# Altium project Sidekick Carrier - Rev. 1.PrjPcb (part 4 of 6)

## Sheet 11 Camera Input.SchDoc
size C; DocumentNumber: 11; SheetNumber: 11; SheetTotal: 17
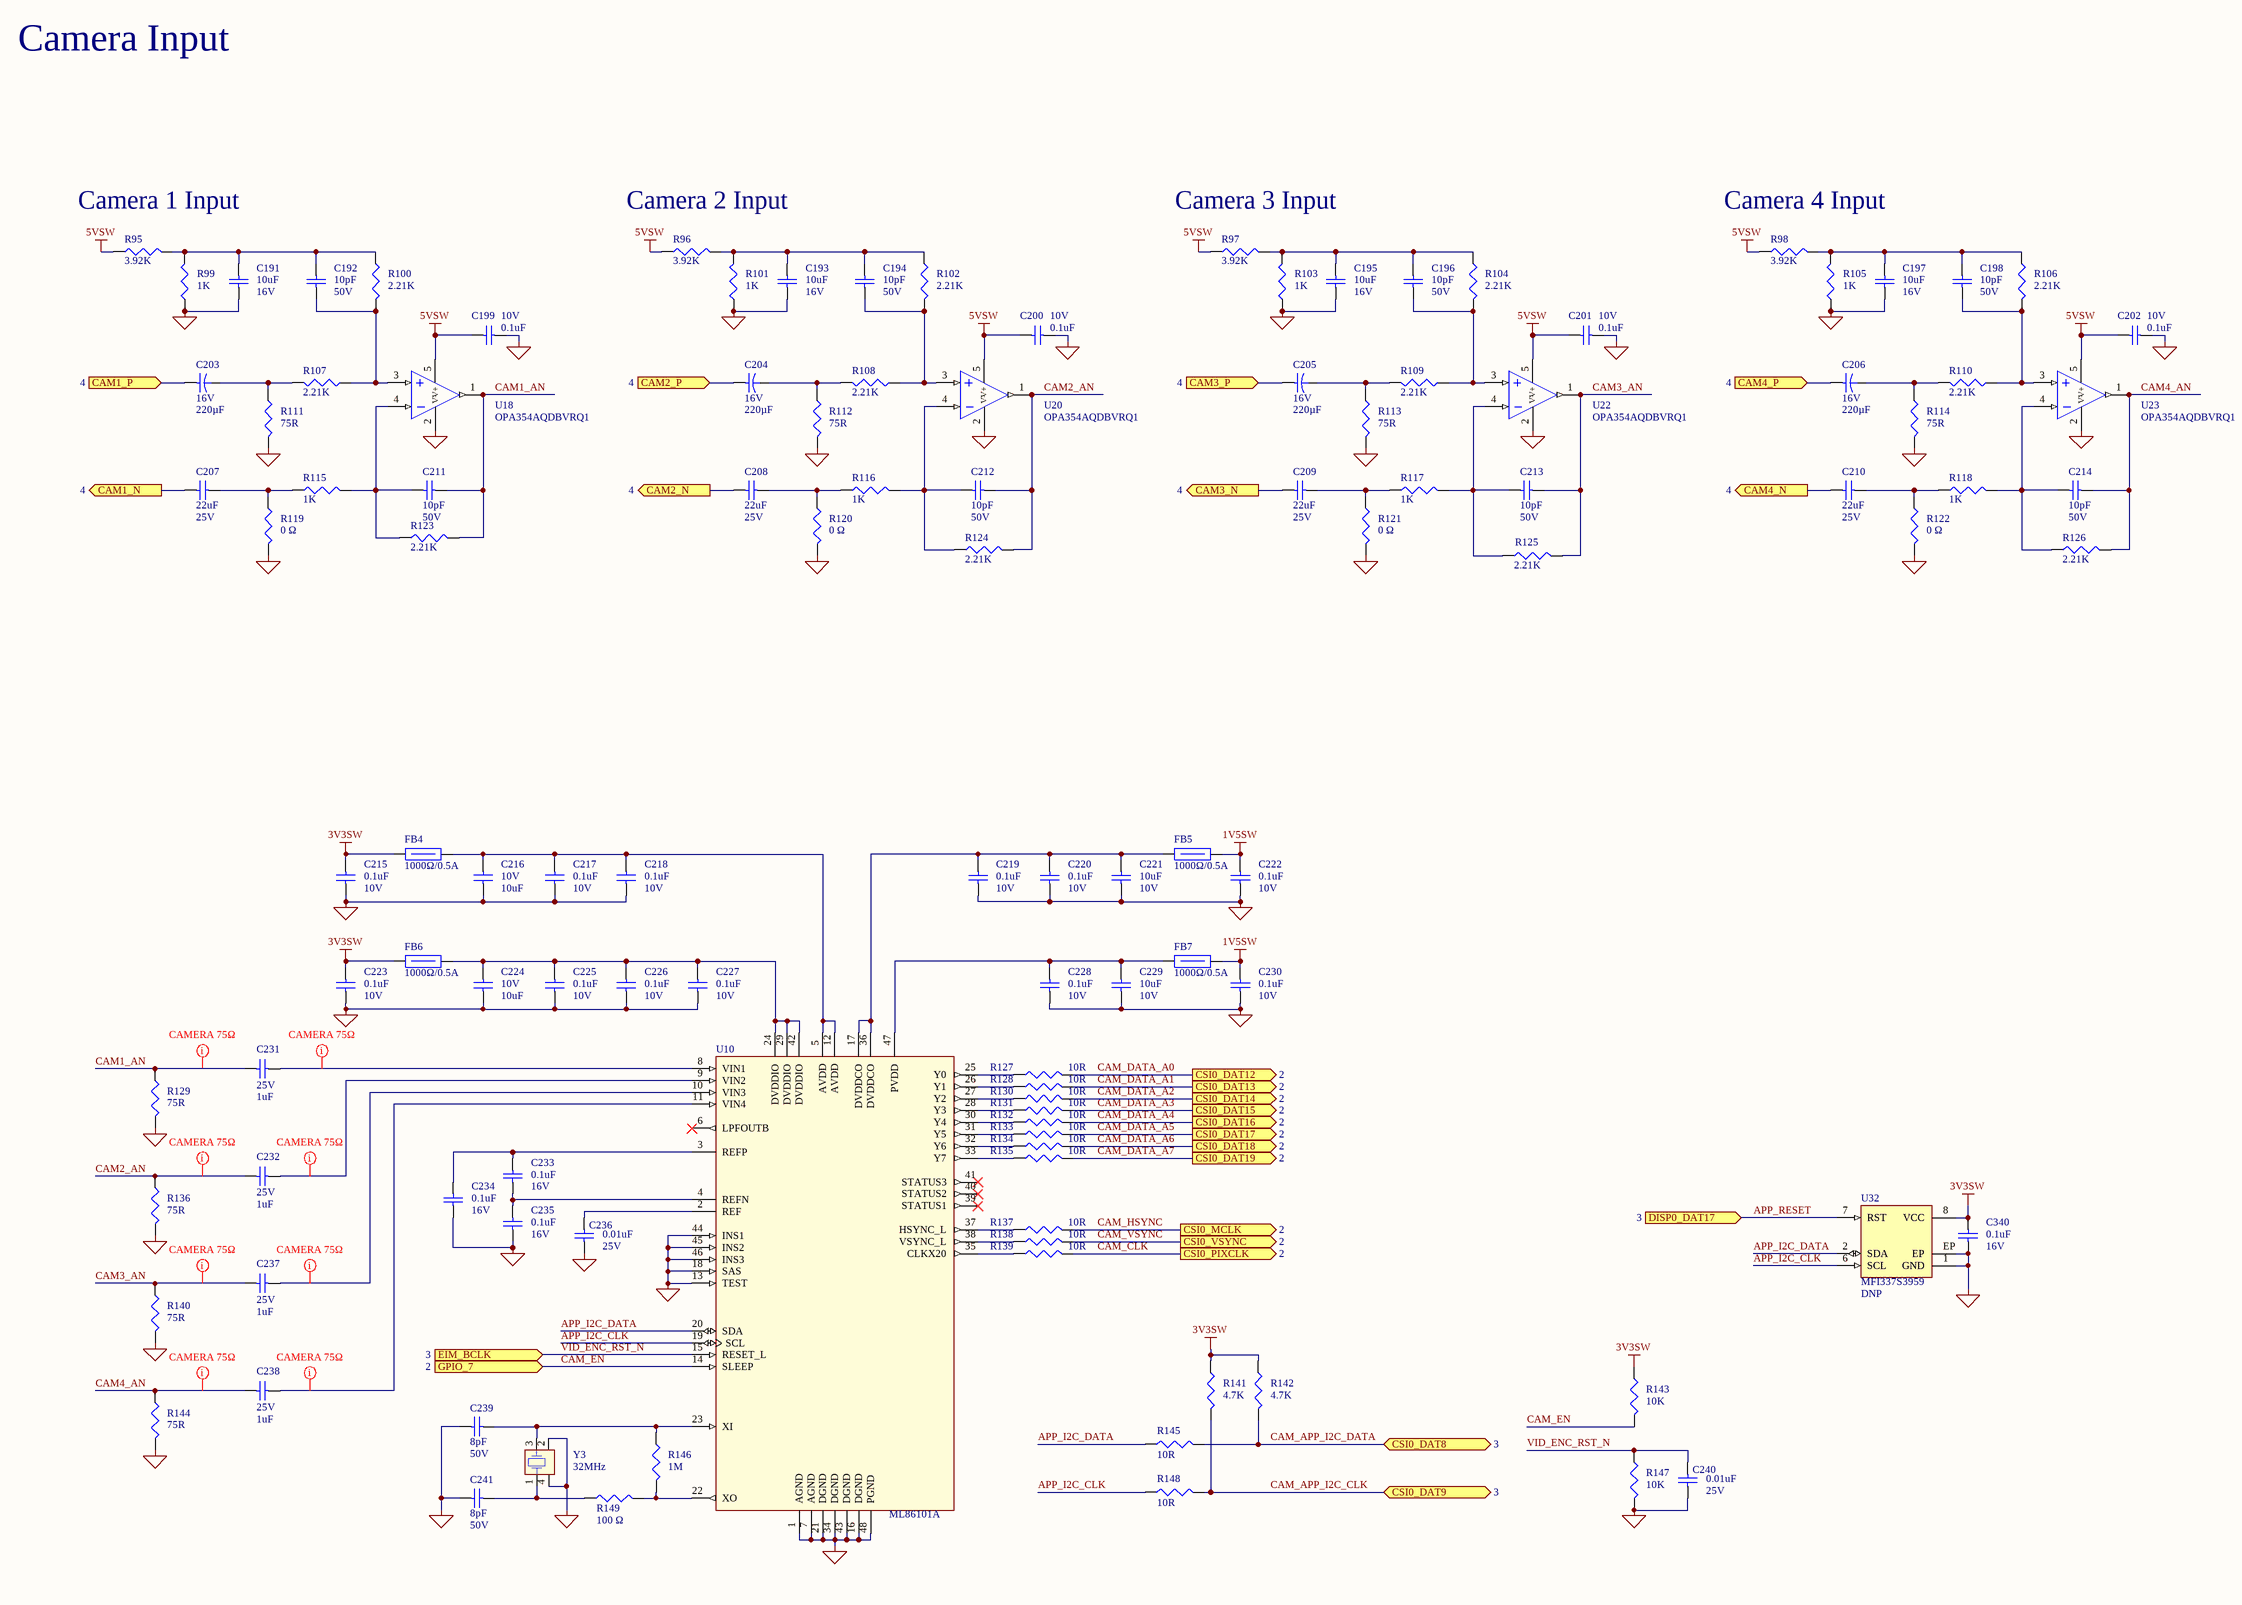
[diagram p10: 11 Camera Input.SchDoc]

### Parts
C191  value 10uF  Voltage: 16V  [CAP_0603]  (hidden comment: Cap 10uF 16V 0603)
C192  value 10pF  Voltage: 50V  [CAP_0402]  (hidden comment: Cap 10pF 50V 0402)
C193  value 10uF  Voltage: 16V  [CAP_0603]  (hidden comment: Cap 10uF 16V 0603)
C194  value 10pF  Voltage: 50V  [CAP_0402]  (hidden comment: Cap 10pF 50V 0402)
C195  value 10uF  Voltage: 16V  [CAP_0603]  (hidden comment: Cap 10uF 16V 0603)
C196  value 10pF  Voltage: 50V  [CAP_0402]  (hidden comment: Cap 10pF 50V 0402)
C197  value 10uF  Voltage: 16V  [CAP_0603]  (hidden comment: Cap 10uF 16V 0603)
C198  value 10pF  Voltage: 50V  [CAP_0402]  (hidden comment: Cap 10pF 50V 0402)
C199  value 0.1uF  Voltage: 10V  [CAP_0402]  (hidden comment: Cap 0.1uF 10V 0402)
C200  value 0.1uF  Voltage: 10V  [CAP_0402]  (hidden comment: Cap 0.1uF 10V 0402)
C201  value 0.1uF  Voltage: 10V  [CAP_0402]  (hidden comment: Cap 0.1uF 10V 0402)
C202  value 0.1uF  Voltage: 10V  [CAP_0402]  (hidden comment: Cap 0.1uF 10V 0402)
C203  value 220µF  Voltage: 16V  [SMD(6.6x6.6)_UWT1C221MCL1GS]  (hidden comment: Cap 220µF 16V)
C204  value 220µF  Voltage: 16V  [SMD(6.6x6.6)_UWT1C221MCL1GS]  (hidden comment: Cap 220µF 16V)
C205  value 220µF  Voltage: 16V  [SMD(6.6x6.6)_UWT1C221MCL1GS]  (hidden comment: Cap 220µF 16V)
C206  value 220µF  Voltage: 16V  [SMD(6.6x6.6)_UWT1C221MCL1GS]  (hidden comment: Cap 220µF 16V)
C207  value 22uF  Voltage: 25V  [CAP_0805]  (hidden comment: Cap 22uF 25V 0805)
C208  value 22uF  Voltage: 25V  [CAP_0805]  (hidden comment: Cap 22uF 25V 0805)
C209  value 22uF  Voltage: 25V  [CAP_0805]  (hidden comment: Cap 22uF 25V 0805)
C210  value 22uF  Voltage: 25V  [CAP_0805]  (hidden comment: Cap 22uF 25V 0805)
C211  value 10pF  Voltage: 50V  [CAP_0402]  (hidden comment: Cap 10pF 50V 0402)
C212  value 10pF  Voltage: 50V  [CAP_0402]  (hidden comment: Cap 10pF 50V 0402)
C213  value 10pF  Voltage: 50V  [CAP_0402]  (hidden comment: Cap 10pF 50V 0402)
C214  value 10pF  Voltage: 50V  [CAP_0402]  (hidden comment: Cap 10pF 50V 0402)
C215  value 0.1uF  Voltage: 10V  [CAP_0402]  (hidden comment: Cap 0.1uF 10V 0402)
C216  value 10uF  Voltage: 10V  [CAP_0603]  (hidden comment: Cap 10uF 10V 0603)
C217  value 0.1uF  Voltage: 10V  [CAP_0402]  (hidden comment: Cap 0.1uF 10V 0402)
C218  value 0.1uF  Voltage: 10V  [CAP_0402]  (hidden comment: Cap 0.1uF 10V 0402)
C219  value 0.1uF  Voltage: 10V  [CAP_0402]  (hidden comment: Cap 0.1uF 10V 0402)
C220  value 0.1uF  Voltage: 10V  [CAP_0402]  (hidden comment: Cap 0.1uF 10V 0402)
C221  value 10uF  Voltage: 10V  [CAP_0603]  (hidden comment: Cap 10uF 10V 0603)
C222  value 0.1uF  Voltage: 10V  [CAP_0402]  (hidden comment: Cap 0.1uF 10V 0402)
C223  value 0.1uF  Voltage: 10V  [CAP_0402]  (hidden comment: Cap 0.1uF 10V 0402)
C224  value 10uF  Voltage: 10V  [CAP_0603]  (hidden comment: Cap 10uF 10V 0603)
C225  value 0.1uF  Voltage: 10V  [CAP_0402]  (hidden comment: Cap 0.1uF 10V 0402)
C226  value 0.1uF  Voltage: 10V  [CAP_0402]  (hidden comment: Cap 0.1uF 10V 0402)
C227  value 0.1uF  Voltage: 10V  [CAP_0402]  (hidden comment: Cap 0.1uF 10V 0402)
C228  value 0.1uF  Voltage: 10V  [CAP_0402]  (hidden comment: Cap 0.1uF 10V 0402)
C229  value 10uF  Voltage: 10V  [CAP_0603]  (hidden comment: Cap 10uF 10V 0603)
C230  value 0.1uF  Voltage: 10V  [CAP_0402]  (hidden comment: Cap 0.1uF 10V 0402)
C231  value 1uF  Voltage: 25V  [CAP_0402]  (hidden comment: Cap 1uF 25V 0402)
C232  value 1uF  Voltage: 25V  [CAP_0402]  (hidden comment: Cap 1uF 25V 0402)
C233  value 0.1uF  Voltage: 16V  [CAP_0402]  (hidden comment: Cap 0.1uF 16V 0402)
C234  value 0.1uF  Voltage: 16V  [CAP_0402]  (hidden comment: Cap 0.1uF 16V 0402)
C235  value 0.1uF  Voltage: 16V  [CAP_0402]  (hidden comment: Cap 0.1uF 16V 0402)
C236  value 0.01uF  Voltage: 25V  [CAP_0402]  (hidden comment: Cap 0.01uF 50V 0402)
C237  value 1uF  Voltage: 25V  [CAP_0402]  (hidden comment: Cap 1uF 25V 0402)
C238  value 1uF  Voltage: 25V  [CAP_0402]  (hidden comment: Cap 1uF 25V 0402)
C239  value 8pF  Voltage: 50V  [CAP_0402]  (hidden comment: Cap 8pF 50V 0402)
C240  value 0.01uF  Voltage: 25V  [CAP_0402]  (hidden comment: Cap 0.01uF 50V 0402)
C241  value 8pF  Voltage: 50V  [CAP_0402]  (hidden comment: Cap 8pF 50V 0402)
C340  value 0.1uF  Voltage: 16V  [CAP_0402]  (hidden comment: Cap 0.1uF 16V 0402)
FB4  value 1000Ω/0.5A  [IND_0805]  (hidden comment: PE-0805FB102ST)
FB5  value 1000Ω/0.5A  [IND_0805]  (hidden comment: PE-0805FB102ST)
FB6  value 1000Ω/0.5A  [IND_0805]  (hidden comment: PE-0805FB102ST)
FB7  value 1000Ω/0.5A  [IND_0805]  (hidden comment: PE-0805FB102ST)
R95  value 3.92K  [RES_0402]  (hidden comment: Res 3.92K 0.063W)
R96  value 3.92K  [RES_0402]  (hidden comment: Res 3.92K 0.063W)
R97  value 3.92K  [RES_0402]  (hidden comment: Res 3.92K 0.063W)
R98  value 3.92K  [RES_0402]  (hidden comment: Res 3.92K 0.063W)
R99  value 1K  [RES_0402]  (hidden comment: Res 1K 0.063W)
R100  value 2.21K  [RES_0402]  (hidden comment: Res 2.21K 0.063W)
R101  value 1K  [RES_0402]  (hidden comment: Res 1K 0.063W)
R102  value 2.21K  [RES_0402]  (hidden comment: Res 2.21K 0.063W)
R103  value 1K  [RES_0402]  (hidden comment: Res 1K 0.063W)
R104  value 2.21K  [RES_0402]  (hidden comment: Res 2.21K 0.063W)
R105  value 1K  [RES_0402]  (hidden comment: Res 1K 0.063W)
R106  value 2.21K  [RES_0402]  (hidden comment: Res 2.21K 0.063W)
R107  value 2.21K  [RES_0402]  (hidden comment: Res 2.21K 0.063W)
R108  value 2.21K  [RES_0402]  (hidden comment: Res 2.21K 0.063W)
R109  value 2.21K  [RES_0402]  (hidden comment: Res 2.21K 0.063W)
R110  value 2.21K  [RES_0402]  (hidden comment: Res 2.21K 0.063W)
R111  value 75R  [RES_0402]  (hidden comment: Res 75R 0.063W)
R112  value 75R  [RES_0402]  (hidden comment: Res 75R 0.063W)
R113  value 75R  [RES_0402]  (hidden comment: Res 75R 0.063W)
R114  value 75R  [RES_0402]  (hidden comment: Res 75R 0.063W)
R115  value 1K  [RES_0402]  (hidden comment: Res 1K 0.063W)
R116  value 1K  [RES_0402]  (hidden comment: Res 1K 0.063W)
R117  value 1K  [RES_0402]  (hidden comment: Res 1K 0.063W)
R118  value 1K  [RES_0402]  (hidden comment: Res 1K 0.063W)
R119  value 0 Ω  [RES_0402]  (hidden comment: Res 0 ohm 0.1W)
R120  value 0 Ω  [RES_0402]  (hidden comment: Res 0 ohm 0.1W)
R121  value 0 Ω  [RES_0402]  (hidden comment: Res 0 ohm 0.1W)
R122  value 0 Ω  [RES_0402]  (hidden comment: Res 0 ohm 0.1W)
R123  value 2.21K  [RES_0402]  (hidden comment: Res 2.21K 0.063W)
R124  value 2.21K  [RES_0402]  (hidden comment: Res 2.21K 0.063W)
R125  value 2.21K  [RES_0402]  (hidden comment: Res 2.21K 0.063W)
R126  value 2.21K  [RES_0402]  (hidden comment: Res 2.21K 0.063W)
R127  value 10R  [RES_0402]  (hidden comment: Res 10R 0.1W)
R128  value 10R  [RES_0402]  (hidden comment: Res 10R 0.1W)
R129  value 75R  [RES_0402]  (hidden comment: Res 75R 0.063W)
R130  value 10R  [RES_0402]  (hidden comment: Res 10R 0.1W)
R131  value 10R  [RES_0402]  (hidden comment: Res 10R 0.1W)
R132  value 10R  [RES_0402]  (hidden comment: Res 10R 0.1W)
R133  value 10R  [RES_0402]  (hidden comment: Res 10R 0.1W)
R134  value 10R  [RES_0402]  (hidden comment: Res 10R 0.1W)
R135  value 10R  [RES_0402]  (hidden comment: Res 10R 0.1W)
R136  value 75R  [RES_0402]  (hidden comment: Res 75R 0.063W)
R137  value 10R  [RES_0402]  (hidden comment: Res 10R 0.1W)
R138  value 10R  [RES_0402]  (hidden comment: Res 10R 0.1W)
R139  value 10R  [RES_0402]  (hidden comment: Res 10R 0.1W)
R140  value 75R  [RES_0402]  (hidden comment: Res 75R 0.063W)
R141  value 4.7K  [RES_0402]  (hidden comment: Res 4.7K 0.063W)
R142  value 4.7K  [RES_0402]  (hidden comment: Res 4.7K 0.063W)
R143  value 10K  [RES_0402]  (hidden comment: Res 10K 0.063W)
R144  value 75R  [RES_0402]  (hidden comment: Res 75R 0.063W)
R145  value 10R  [RES_0402]  (hidden comment: Res 10R 0.1W)
R146  value 1M  [RES_0402]  (hidden comment: Res 1M 0.063W)
R147  value 10K  [RES_0402]  (hidden comment: Res 10K 0.063W)
R148  value 10R  [RES_0402]  (hidden comment: Res 10R 0.1W)
R149  value 100 Ω  [RES_0402]  (hidden comment: Res 100R 0.063W)
U10  ML86101A  [TQFP-48_ML86101A]
U18  OPA354AQDBVRQ1  [SOT-23-5_OPA354A-Q1]
U20  OPA354AQDBVRQ1  [SOT-23-5_OPA354A-Q1]
U22  OPA354AQDBVRQ1  [SOT-23-5_OPA354A-Q1]
U23  OPA354AQDBVRQ1  [SOT-23-5_OPA354A-Q1]
U32  MFI337S3959  [CP8PMFI-MFI337S3959]
Y3  value 32MHz  [DFN(3.2x2.5)_CX3225SB32000D0FPLCC]  (hidden comment: CX3225SB32000D0FPLCC)

### Ports
CAM1_N (out, see 4), CAM1_P (in, see 4), CAM2_N (out, see 4), CAM2_P (in, see 4), CAM3_N (out, see 4), CAM3_P (in, see 4), CAM4_N (out, see 4), CAM4_P (in, see 4), CSI0_DAT8 (bidir, see 3), CSI0_DAT9 (bidir, see 3), CSI0_DAT12 (out, see 2), CSI0_DAT13 (out, see 2), CSI0_DAT14 (out, see 2), CSI0_DAT15 (out, see 2), CSI0_DAT16 (out, see 2), CSI0_DAT17 (out, see 2), CSI0_DAT18 (out, see 2), CSI0_DAT19 (out, see 2), CSI0_MCLK (out, see 2), CSI0_PIXCLK (out, see 2), CSI0_VSYNC (out, see 2), DISP0_DAT17 (in, see 3), EIM_BCLK (in, see 3), GPIO_7 (in, see 2)

### Nets
1V5SW: C222.1 C230.1 FB5.2 FB7.2
3V3SW: C215.1 C223.1 C340.1 FB4.1 FB6.1 R141.1 R142.1 R143.1 U32.8(VCC)
5VSW: C199.1 C200.1 C201.1 C202.1 R95.1 R96.1 R97.1 R98.1 U18.5(V+) U20.5(V+) U22.5(V+) U23.5(V+)
GND: C191.2 C193.2 C195.2 C197.2 C199.2 C200.2 C201.2 C202.2 C215.2 C216.2 C217.2 C218.2 C219.2 C220.2 C221.2 C222.2 C223.2 C224.2 C225.2 C226.2 C227.2 C228.2 C229.2 C230.2 C234.2 C235.2 C236.2 C239.1 C240.2 C241.1 C340.2 R99.1 R101.1 R103.1 R105.1 R111.2 R112.2 R113.2 R114.2 R119.2 R120.2 R121.2 R122.2 R129.2 R136.2 R140.2 R144.2 R147.2 U10.1(AGND) U10.7(AGND) U10.13(TEST) U10.16(DGND) U10.18(SAS) U10.21(DGND) U10.34(DGND) U10.43(DGND) U10.44(INS1) U10.45(INS2) U10.46(INS3) U10.48(PGND) U18.2(V-) U20.2(V-) U22.2(V-) U23.2(V-) U32.1(GND) U32.EP Y3.2 Y3.4
APP_I2C_CLK: R148.1 U10.19(SCL) U32.6(SCL)
APP_I2C_DATA: R145.1 U10.20(SDA) U32.2(SDA)
APP_RESET: U32.7(RST) ; port DISP0_DAT17
CAM1_AN: C211.2 C231.1 R123.2 R129.1 U18.1(OUT)
CAM1_N: C207.1 ; port CAM1_N
CAM1_P: C203.1 ; port CAM1_P
CAM2_AN: C212.2 C232.1 R124.2 R136.1 U20.1(OUT)
CAM2_N: C208.1 ; port CAM2_N
CAM2_P: C204.1 ; port CAM2_P
CAM3_AN: C213.2 C237.1 R125.2 R140.1 U22.1(OUT)
CAM3_N: C209.1 ; port CAM3_N
CAM3_P: C205.1 ; port CAM3_P
CAM4_AN: C214.2 C238.1 R126.2 R144.1 U23.1(OUT)
CAM4_N: C210.1 ; port CAM4_N
CAM4_P: C206.1 ; port CAM4_P
CAM_APP_I2C_CLK: R141.2 R148.2 ; port CSI0_DAT9
CAM_APP_I2C_DATA: R142.2 R145.2 ; port CSI0_DAT8
CAM_CLK: R139.2 ; port CSI0_PIXCLK
CAM_DATA_A0: R127.2 ; port CSI0_DAT12
CAM_DATA_A1: R128.2 ; port CSI0_DAT13
CAM_DATA_A2: R130.2 ; port CSI0_DAT14
CAM_DATA_A3: R131.2 ; port CSI0_DAT15
CAM_DATA_A4: R132.2 ; port CSI0_DAT16
CAM_DATA_A5: R133.2 ; port CSI0_DAT17
CAM_DATA_A6: R134.2 ; port CSI0_DAT18
CAM_DATA_A7: R135.2 ; port CSI0_DAT19
CAM_EN: R143.2 U10.14(SLEEP) ; port GPIO_7
CAM_HSYNC: R137.2 ; port CSI0_MCLK
CAM_VSYNC: R138.2 ; port CSI0_VSYNC
VID_ENC_RST_N: C240.1 R147.1 U10.15(RESET_L) ; port EIM_BCLK
NetC191_1: C191.1 C192.2 R95.2 R99.2 R100.1
NetC192_1: C192.1 R100.2 R107.1 U18.3(IN+)
NetC193_1: C193.1 C194.2 R96.2 R101.2 R102.1
NetC194_1: C194.1 R102.2 R108.1 U20.3(IN+)
NetC195_1: C195.1 C196.2 R97.2 R103.2 R104.1
NetC196_1: C196.1 R104.2 R109.1 U22.3(IN+)
NetC197_1: C197.1 C198.2 R98.2 R105.2 R106.1
NetC198_1: C198.1 R106.2 R110.1 U23.3(IN+)
NetC203_2: C203.2 R107.2 R111.1
NetC204_2: C204.2 R108.2 R112.1
NetC205_2: C205.2 R109.2 R113.1
NetC206_2: C206.2 R110.2 R114.1
NetC207_2: C207.2 R115.1 R119.1
NetC208_2: C208.2 R116.1 R120.1
NetC209_2: C209.2 R117.1 R121.1
NetC210_2: C210.2 R118.1 R122.1
NetC211_1: C211.1 R115.2 R123.1 U18.4(IN-)
NetC212_1: C212.1 R116.2 R124.1 U20.4(IN-)
NetC213_1: C213.1 R117.2 R125.1 U22.4(IN-)
NetC214_1: C214.1 R118.2 R126.1 U23.4(IN-)
NetC216_1: C216.1 C217.1 C218.1 FB4.2 U10.5(AVDD) U10.12(AVDD)
NetC219_1: C219.1 C220.1 C221.1 FB5.1 U10.17(DVDDCO) U10.36(DVDDCO)
NetC224_1: C224.1 C225.1 C226.1 C227.1 FB6.2 U10.24(DVDDIO) U10.29(DVDDIO) U10.42(DVDDIO)
NetC228_1: C228.1 C229.1 FB7.1 U10.47(PVDD)
NetC231_2: C231.2 U10.8(VIN1)
NetC232_2: C232.2 U10.9(VIN2)
NetC233_1: C233.1 C234.1 U10.3(REFP)
NetC233_2: C233.2 C235.1 U10.4(REFN)
NetC236_1: C236.1 U10.2(REF)
NetC237_2: C237.2 U10.10(VIN3)
NetC238_2: C238.2 U10.11(VIN4)
NetC239_2: C239.2 R146.1 U10.23(XI) Y3.3(OSC2)
NetC241_2: C241.2 R149.1 Y3.1(OSC1)
NetR127_1: R127.1 U10.25(Y0)
NetR128_1: R128.1 U10.26(Y1)
NetR130_1: R130.1 U10.27(Y2)
NetR131_1: R131.1 U10.28(Y3)
NetR132_1: R132.1 U10.30(Y4)
NetR133_1: R133.1 U10.31(Y5)
NetR134_1: R134.1 U10.32(Y6)
NetR135_1: R135.1 U10.33(Y7)
NetR137_1: R137.1 U10.37(HSYNC_L)
NetR138_1: R138.1 U10.38(VSYNC_L)
NetR139_1: R139.1 U10.35(CLKX20)
NetR146_2: R146.2 R149.2 U10.22(XO)

Not connected (* = marked no-connect by the designer): U10 6(LPFOUTB)* 39(STATUS1)* 40(STATUS2)* 41(STATUS3)*

### Layout directives
net class CAMERA 75ohm: CAM1_AN, CAM2_AN, CAM3_AN, CAM4_AN, NetC231_2, NetC232_2, NetC237_2, NetC238_2

### Notes on the sheet
- Camera Input
- Camera 1 Input
- Camera 2 Input
- Camera 3 Input
- Camera 4 Input
- First View Consultants
- Austin, Tx
- 512.582.9102
- firstviewconsultants.com
- Title:
- File:
- Drawn:
- Sheet
- of
- FVC #:
- Checked:
- Approved:
- Date:
- Page Size:
- C
- Rev.
- Time:

### Library data of the parts
C191 C193 C195 C197 = Cap 10uF 16V 0603: Cap, Cer, 10uF, 16V, 20%, X5R, 0603; Manufacturer #: GRM188C81C106MA73D; Manufacturer: Murata Electronics North America; Have Footprint: yes; RoHS: yes; Tolerance: ±20%; Operating Temperature: -55°C ~ 85°C; Package: 0603
C192 C194 C196 C198 C211-C214 = Cap 10pF 50V 0402: Cap, Cer, 10pF, 50V, 5%, C0G/NP0, 0402; Manufacturer: Yageo; Manufacturer #: CC0402JRNPO9BN100; Have Footprint: yes; Tolerance: 5%; PACKAGE: 0402; Operating Temperature: -55°C ~ 125°C
C199-C202 C215 C217-C220 C222 C223 C225-C228 C230 = Cap 0.1uF 10V 0402: Cap, Cer, 0.1uF, 10V, 10%, X5R, 0402; Manufacturer: Murata Electronics North America; Manufacturer #: GRM155R61A104KA01J; Have Footprint: yes; Tolerance: ±10%; PACKAGE: 0402
C203-C206 = Cap 220µF 16V: Cap, Alum, 220µF, 16V, 20%, SMD; Manufacturer #: UWT1C221MCL1GS; Manufacturer: Nichicon; Tolerance: 20%; Package: SMD  (6.6x6.6); Operating Temperature: -55°C ~ 105°C
C207-C210 = Cap 22uF 25V 0805: Cap, Cer, 22uF, 25V, 20%, X5R, 0805; Manufacturer #: CL21A226MAQNNNE; Manufacturer: Samsung Electro-Mechanics America, Inc; Have Footprint: yes; Tolerance: ±20%; Package: 0805
C216 C221 C224 C229 = Cap 10uF 10V 0603: Cap, Cer, 10uF, 10V, 10%, X5R, 0603; Manufacturer #: C1608X5R1A106K080AC; Manufacturer: TDK Corporation; Have Footprint: yes; Package: 0603; Tolerance: ±10%
C231 C232 C237 C238 = Cap 1uF 25V 0402: Cap, Cer, 1uF, 25V, 10%, X5R, 0402; Manufacturer #: TMK105BJ105MV-F; Manufacturer: Taiyo Yuden; Have Footprint: yes; Package: 0402
C233-C235 C340 = Cap 0.1uF 16V 0402: Cap, Cer, 0.1uF, 16V, 10%, X7R, 0402; Manufacturer #: GRM155R71C104KA88D; Manufacturer: Murata Electronics North America; Have Footprint: yes; Package: 0402; Tolerance: ±10%
C236 C240 = Cap 0.01uF 50V 0402: Cap, Cer, 0.01uF, 25V, ±10%, X7R, 0402; Manufacturer #: GRM155R71E103KA01J; Manufacturer: Murata; Have Footprint: yes; Tolerance: ±10%; Package: 0402
C239 C241 = Cap 8pF 50V 0402: Cap, Cer, 8pF, 50V, ±0.5pF, C0G/NP0, 0402; Manufacturer: Murata Electronics North America; Manufacturer #: GRM1555C1H8R0DA01D; Have Footprint: yes; Tolerance: ±0.5pF; PACKAGE: 0402; Operating Temperature: -55°C ~ 125°C
FB4-FB7 = PE-0805FB102ST: Ind, Ferrite Bead, 1000R, 0.5A, 400mOhm, 0805; Manufacturer: Pulse Electronics Corporation; Manufacturer #: PE-0805FB102ST; Package: 0805
R95-R98 = Res 3.92K 0.063W: Res, 3.92K, 0.063W, 1%, 0402; Manufacturer #: MCR01MRTF3921; Manufacturer: Rohm Semiconductor; Have Footprint: yes; Package: 0402; Operating Temperature: -55°C ~ 155°C; Tolerance: 1%
R99 R101 R103 R105 R115-R118 = Res 1K 0.063W: Res, 1K, 0.063W, 1%, 0402; Manufacturer #: CRCW04021K00FKED; Manufacturer: Vishay Dale; Have Footprint: yes; Package: 0402; Tolerance: ±1%
R100 R102 R104 R106-R110 R123-R126 = Res 2.21K 0.063W: Res, 2.21K, 0.063W, 1%, 0402; Manufacturer #: RC0402FR-072K21L; Manufacturer: Yageo; Have Footprint: yes; Package: 0402; Operating Temperature: -55°C ~ 155°C; Tolerance: 1%
R111-R114 R129 R136 R140 R144 = Res 75R 0.063W: Res, 2.21K, 0.063W, 1%, 0402; Manufacturer #: MCR01MRTF75R0; Manufacturer: Rohm Semiconductor; Have Footprint: yes; Package: 0402; Operating Temperature: -55°C ~ 155°C; Tolerance: 1%
R119-R122 = Res 0 ohm 0.1W: Res, 0 ohm, 1/16W, 0402; Manufacturer #: CRCW04020000Z0ED; Manufacturer: Vishay Dale; Have Footprint: yes; Package: 0402
R127 R128 R130-R135 R137-R139 R145 R148 = Res 10R 0.1W: Res, 10R, 0.1W, 0402; Manufacturer #: ERJ-2GEJ100X; Manufacturer: Panasonic Electronic Components; Have Footprint: yes; Package: 0402
R141 R142 = Res 4.7K 0.063W: Res, 4.70K, 0.063W, 1%, 0402; Manufacturer #: CRCW04024K70FKED; Manufacturer: Vishay Dale; Have Footprint: yes; Package: 0402
R143 R147 = Res 10K 0.063W: Res, 10K, 1/16W, 1%, 0402; Manufacturer #: RC0402FR-0710KL; Manufacturer: Yageo; Have Footprint: yes; Package: 0402
R146 = Res 1M 0.063W: Res, 1M, 0.063W, 1%, 0402; Manufacturer #: RC0402FR-071ML; Manufacturer: Yageo; Have Footprint: yes; Package: 0402
R149 = Res 100R 0.063W: Res, 100R, 0.063W, 1%, 0402; Manufacturer #: TRR01MZPF1000; Manufacturer: Murata Electronics North America; Have Footprint: yes; Package: 0402
U10 = ML86101A: IC, Video Decoder, I2C, 4-composite/2-S-video input, TQFP-48; Manufacturer: Lapis Semiconductor; Have Footprint: yes; Manufacturer #: ML86101A; Package: TQFP-48
U18 U20 U22 U23 = OPA354AQDBVRQ1: IC, OpAmp, 250MHz, R-R I/O, SOT-23-5; Manufacturer: Texas Instruments; Have Footprint: yes; Package: SOT-23-5; RoHS: yes; Manufacturer #: OPA354AQDBVRQ1
U32 = MFI337S3959: IC, Apple Authentication Coprocessor, 2.0C, 8USON; Have Footprint: yes; DNP: DNP; Manufacturer #: MFI337S3959; Manufacturer: Apple
Y3 = CX3225SB32000D0FPLCC: Clock, Crystal, 32MHz, 20ppm, 8pF, SMD; Manufacturer: AVX Corp/Kyocera Corp; Operating Temperature: -40°C ~ 85°C; Package: DFN(3.2x2.5); Manufacturer #: CX3225SB32000D0FPLCC

## Sheet 12 CAN, ADC, DAC.SchDoc
size B; DocumentNumber: 12; SheetNumber: 12; SheetTotal: 17
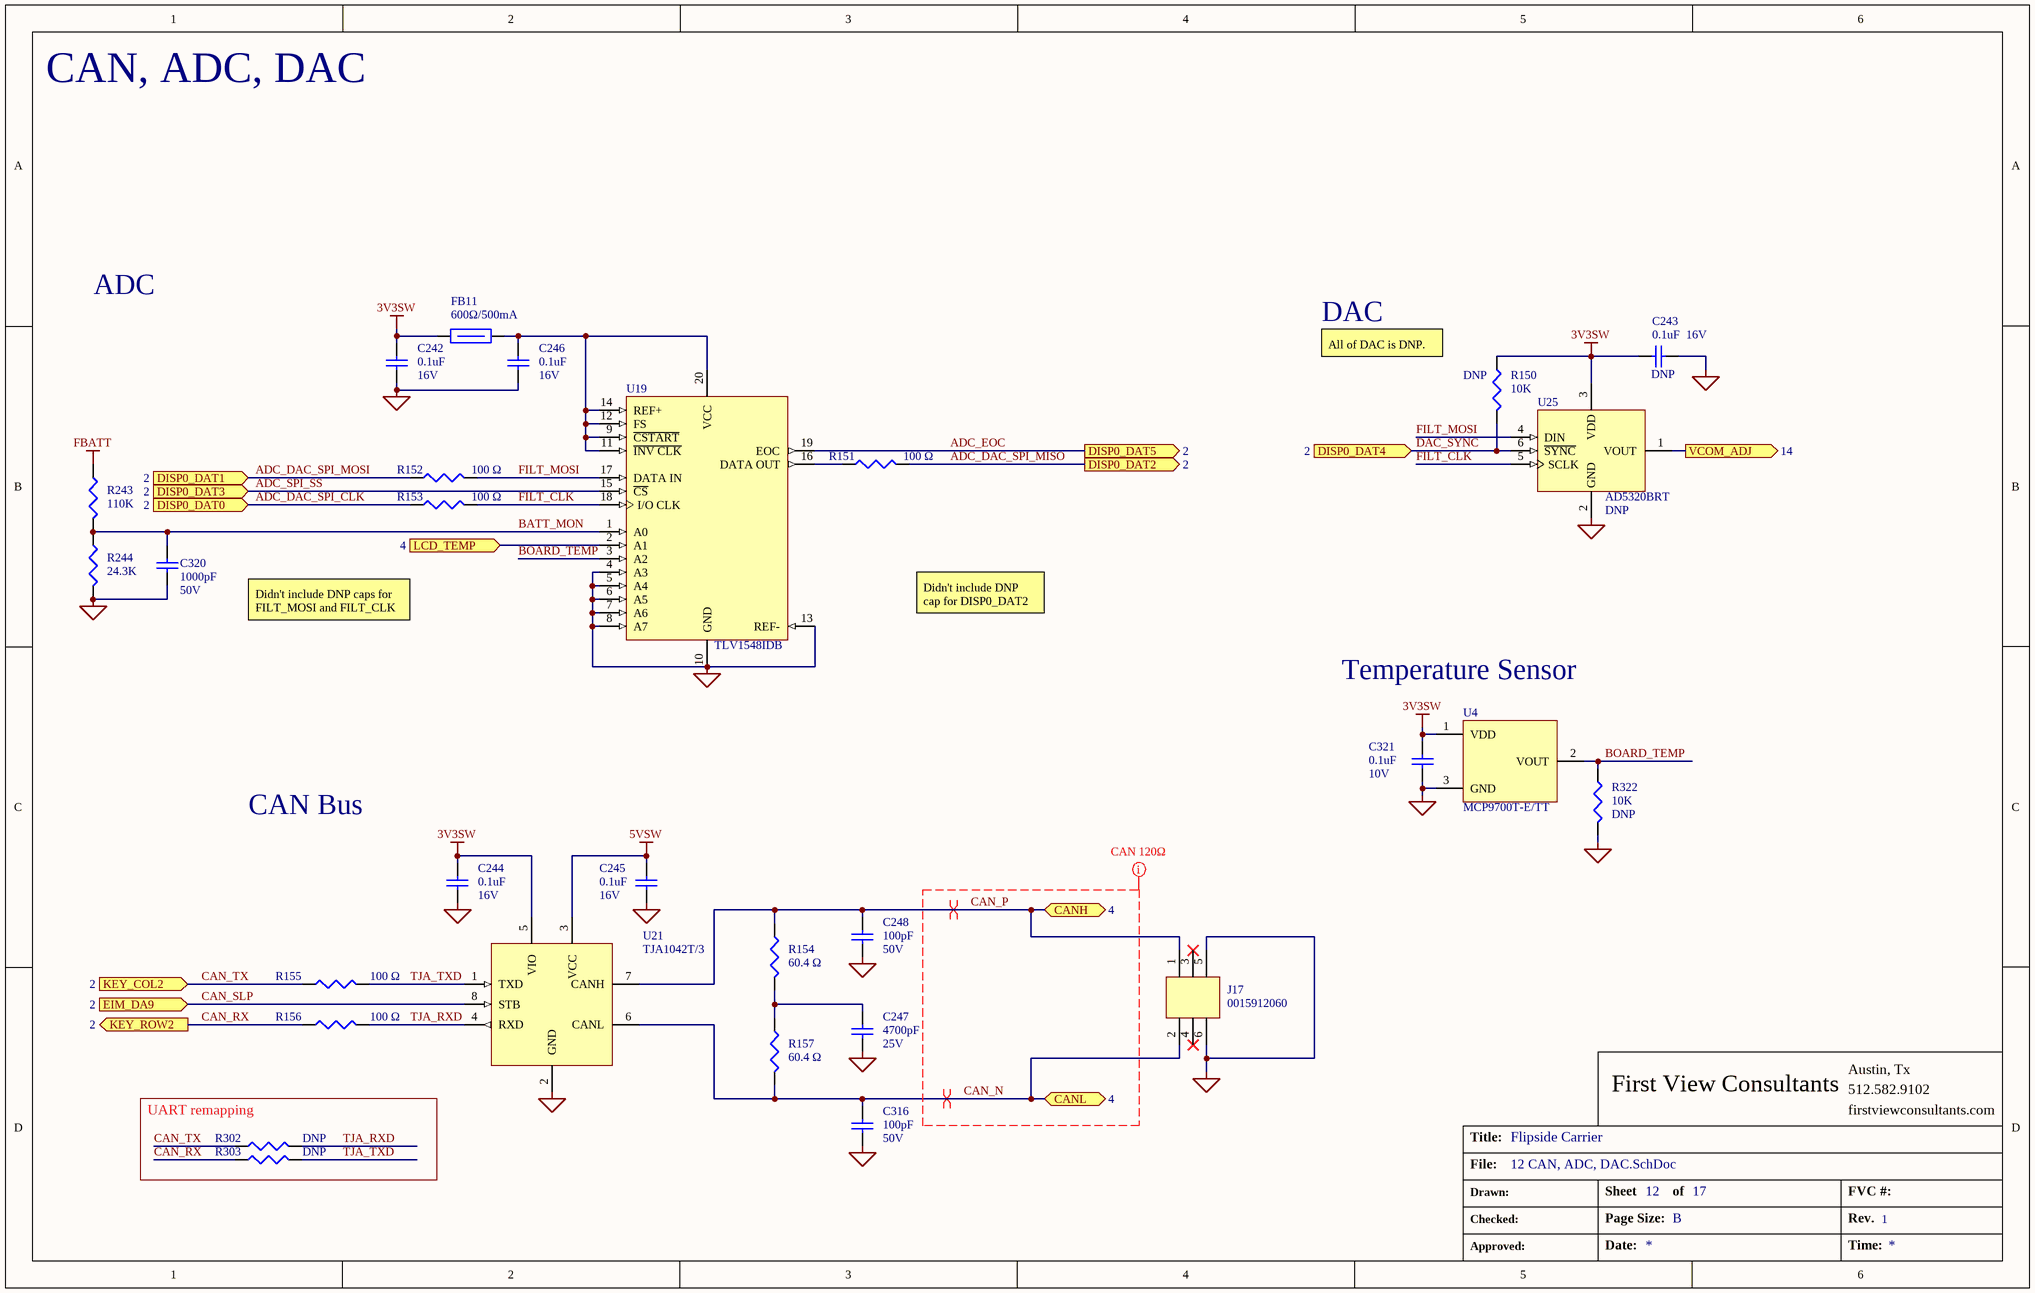
[diagram p11: 12 CAN, ADC, DAC.SchDoc]

### Parts
C242  value 0.1uF  Voltage: 16V  [CAP_0402]  (hidden comment: Cap 0.1uF 16V 0402)
C243  value 0.1uF  Voltage: 16V  [CAP_0402]  (hidden comment: Cap 0.1uF 16V 0402)
C244  value 0.1uF  Voltage: 16V  [CAP_0402]  (hidden comment: Cap 0.1uF 16V 0402)
C245  value 0.1uF  Voltage: 16V  [CAP_0402]  (hidden comment: Cap 0.1uF 16V 0402)
C246  value 0.1uF  Voltage: 16V  [CAP_0402]  (hidden comment: Cap 0.1uF 16V 0402)
C247  value 4700pF  Voltage: 25V  [CAP_0603]  (hidden comment: Cap 4700pF 25V 0603)
C248  value 100pF  Voltage: 50V  [CAP_0402]  (hidden comment: Cap 100pF 50V 0402)
C316  value 100pF  Voltage: 50V  [CAP_0402]  (hidden comment: Cap 100pF 50V 0402)
C320  value 1000pF  Voltage: 50V  [CAP_0402]  (hidden comment: Cap 1000pF 50V 0402)
C321  value 0.1uF  Voltage: 10V  [CAP_0402]  (hidden comment: Cap 0.1uF 10V 0402)
FB11  value 600Ω/500mA  [IND_0603]  (hidden comment: BLM18EG601SN1D)
J17  0015912060  [CON_0015912060]
R150  value 10K  [RES_0402]  (hidden comment: Res 10K 0.063W)
R151  value 100 Ω  [RES_0402]  (hidden comment: Res 100R 0.063W)
R152  value 100 Ω  [RES_0402]  (hidden comment: Res 100R 0.063W)
R153  value 100 Ω  [RES_0402]  (hidden comment: Res 100R 0.063W)
R154  value 60.4 Ω  [RES_0402]  (hidden comment: Res 60.4R 0.063W)
R155  value 100 Ω  [RES_0402]  (hidden comment: Res 100R 0.063W)
R156  value 100 Ω  [RES_0402]  (hidden comment: Res 100R 0.063W)
R157  value 60.4 Ω  [RES_0402]  (hidden comment: Res 60.4R 0.063W)
R243  value 110K  [RES_0402]  (hidden comment: Res 110K 0.063W)
R244  value 24.3K  [RES_0402]  (hidden comment: Res 24.3K 0.063W)
R302  Res 100R 0.063W  [RES_0402]  (value not drawn)
R303  Res 100R 0.063W  [RES_0402]  (value not drawn)
R322  value 10K  [RES_0402]  (hidden comment: Res 10K 0.063W)
U4  MCP9700T-E/TT  [SOT-23-3_MCP9700T-E/TT]
U19  TLV1548IDB  [SSOP-20_TLV1548IDB]
U21  TJA1042T/3  [SOIC-8_TJA1042T/3]
U25  AD5320BRT  [SOT-23-6_AD5320BRT]

### Blocks framed on the sheet
UART remapping: R302 R303

### Ports
CANH (bidir, see 4), CANL (bidir, see 4), DISP0_DAT0 (in, see 2), DISP0_DAT1 (in, see 2), DISP0_DAT2 (out, see 2), DISP0_DAT3 (in, see 2), DISP0_DAT4 (in, see 2), DISP0_DAT5 (out, see 2), EIM_DA9 (in, see 2), KEY_COL2 (in, see 2), KEY_ROW2 (out, see 2), LCD_TEMP (in, see 4), VCOM_ADJ (out, see 14)

### Nets
3V3SW: C242.2 C243.1 C244.1 C321.1 FB11.1 R150.1 U4.1(VDD) U21.5(VIO) U25.3(VDD)
5VSW: C245.1 U21.3(VCC)
FBATT: R243.1
GND: C242.1 C243.2 C244.2 C245.2 C246.1 C247.2 C248.2 C316.2 C320.2 C321.2 J17.5 J17.6 R244.2 R322.2 U4.3(GND) U19.4(A3) U19.5(A4) U19.6(A5) U19.7(A6) U19.8(A7) U19.10(GND) U19.13(REF-) U21.2(GND) U25.2(GND)
ADC_DAC_SPI_CLK: R153.1 ; port DISP0_DAT0
ADC_DAC_SPI_MISO: R151.2 ; port DISP0_DAT2
ADC_DAC_SPI_MOSI: R152.1 ; port DISP0_DAT1
ADC_EOC: U19.19(EOC) ; port DISP0_DAT5
ADC_SPI_SS: U19.15(~{CS}) ; port DISP0_DAT3
BATT_MON: C320.1 R243.2 R244.1 U19.1(A0)
BOARD_TEMP: R322.1 U4.2(VOUT) U19.3(A2)
CAN_N: C316.1 J17.2 R157.2 U21.6(CANL) ; port CANL
CAN_P: C248.1 J17.1 R154.1 U21.7(CANH) ; port CANH
CAN_RX: R156.1 R303.1 ; port KEY_ROW2
CAN_SLP: U21.8(STB) ; port EIM_DA9
CAN_TX: R155.1 R302.1 ; port KEY_COL2
DAC_SYNC: R150.2 U25.6(~{SYNC}) ; port DISP0_DAT4
FILT_CLK: R153.2 U19.18(I/O_CLK) U25.5(SCLK)
FILT_MOSI: R152.2 U19.17(DATA_IN) U25.4(DIN)
TJA_RXD: R156.2 R302.2 U21.4(RXD)
TJA_TXD: R155.2 R303.2 U21.1(TXD)
NetC45_1: U19.2(A1) ; port LCD_TEMP
NetC246_2: C246.2 FB11.2 U19.9(~{CSTART}) U19.11(~{INV_CLK}) U19.12(FS) U19.14(REF+) U19.20(VCC)
NetC247_1: C247.1 R154.2 R157.1
NetR151_1: R151.1 U19.16(DATA_OUT)
NetR222_2: U25.1(VOUT) ; port VCOM_ADJ

Not connected (* = marked no-connect by the designer): J17 3* 4*

### Layout directives
differential pair: CAN_N, CAN_P
net class CAN 120ohm: CAN_N, CAN_P

### Notes on the sheet
- CAN, ADC, DAC
- ADC
- DAC
- All of DAC is DNP.
- Didn't include DNP caps for FILT_MOSI and FILT_CLK
- Didn't include DNP cap for DISP0_DAT2
- Temperature Sensor
- CAN Bus
- First View Consultants
- Austin, Tx
- 512.582.9102
- Title:
- File:
- firstviewconsultants.com
- Drawn:
- Checked:
- Sheet
- Page Size:
- of
- B
- FVC #:
- Rev.
- Approved:
- Date:
- Time:

### Library data of the parts
C242-C246 = Cap 0.1uF 16V 0402: as C233-C235 on sheet 11 Camera Input; Package: 0402; Tolerance: ±10%
  C243: DNP: DNP
C247 = Cap 4700pF 25V 0603: Cap, Cer, 4700pF, 25V, 5%, C0G, 0603; Manufacturer: TDK Corporation; Manufacturer #: C1608C0G1E472J080AA; Have Footprint: yes; Tolerance: 5%; PACKAGE: 0603
C248 C316 = Cap 100pF 50V 0402: Cap, Cer, 100pF, 50V, 5%, C0G/NP0, 0402; Manufacturer #: CC0402JRNPO9BN101; Manufacturer: Yageo; Have Footprint: yes; PACKAGE: 0402; Tolerance: 5%
C320 = Cap 1000pF 50V 0402: Cap, Cer, 1000pF, 50V, 20%, X7R, 0402; Manufacturer: Murata Electronics North America; Manufacturer #: GRM155R71H102KA01D; Have Footprint: yes; Tolerance: 20%; PACKAGE: 0402
C321 = Cap 0.1uF 10V 0402: as C199-C202 on sheet 11 Camera Input; Tolerance: ±10%; PACKAGE: 0402
FB11 = BLM18EG601SN1D: Ind, Ferrite Bead, 600R, 350mOhm, 0.5A, 0603; Manufacturer: Murata Electronics North America; Have Footprint: yes; Manufacturer #: BLM18EG601SN1D; Package: 0603
J17 = 0015912060: Conn, Header, 6 pos, 0.1" pitch, SMD; Manufacturer: Molex Inc; Have Footprint: yes; Manufacturer #: 0015912060; Cost: 0.43
R150 R322 = Res 10K 0.063W: as R143 on sheet 11 Camera Input; Package: 0402; DNP: DNP
R151-R153 R155 R156 = Res 100R 0.063W: as R149 on sheet 11 Camera Input; Package: 0402
R154 R157 = Res 60.4R 0.063W: Res, 60.4, 1/16W, 1%, 0402; Manufacturer #: RMCF0402FT60R4; Manufacturer: Stackpole Electronics Inc; Have Footprint: yes; Package: 0402
R243 = Res 110K 0.063W: Res, 110K, 0.063W, 5%, 0402; Manufacturer #: MCR01MRTJ114; Manufacturer: Rohm Semiconductor; Have Footprint: yes; Package: 0402; Tolerance: 5%
R244 = Res 24.3K 0.063W: Res, 24.3K, 0.063W, 5%, 0402; Manufacturer #: RMCF0402FT24K3; Manufacturer: Stackpole Electronics Inc; Tolerance: 1%; Have Footprint: yes; Package: 0402
R302 R303 = Res 100R 0.063W: Res, 100R, 0.063W, 1%, 0402; Manufacturer #: TRR01MZPF1000; Manufacturer: Murata Electronics North America; Value: 100 Ω; Have Footprint: yes; Package: 0402; DNP: DNP
U4 = MCP9700T-E/TT: IC, Temp Sensor, 0-70°C, 2.3-5.5V, VSOT-23-3; Manufacturer: Microchip Technology; Have Footprint: yes; Manufacturer #: MCP9700T-E/TT; Package: SOT-23-3; Operating Temperature: -40°C ~ 125°C
U19 = TLV1548IDB: IC, ADC, 8-ch, 10-Bit, SER, 85Ksps, SSOP-20; Manufacturer: Texas Instruments; Package: SSOP-20; RoHS: yes; Manufacturer #: TLV1548IDB
U21 = TJA1042T/3: IC, CAN, 3-5V, SOIC-8; Manufacturer: NXP Semiconductor; Have Footprint: yes; Package: SOIC-8; Operating Temperature: -40°C ~ 150°C; RoHS: YES; Manufacturer #: TJA1042T/3
U25 = AD5320BRT: IC, DAC, 12-Bit, 2.7-5.5V, 140uA, SOT-23; Manufacturer: Analog Devices; Have Footprint: yes; DNP: DNP; Manufacturer #: AD5320BRT

## Sheet 13 LCD Backlight, Touchscreen.SchDoc
size B; DocumentNumber: 13; SheetNumber: 13; SheetTotal: 17
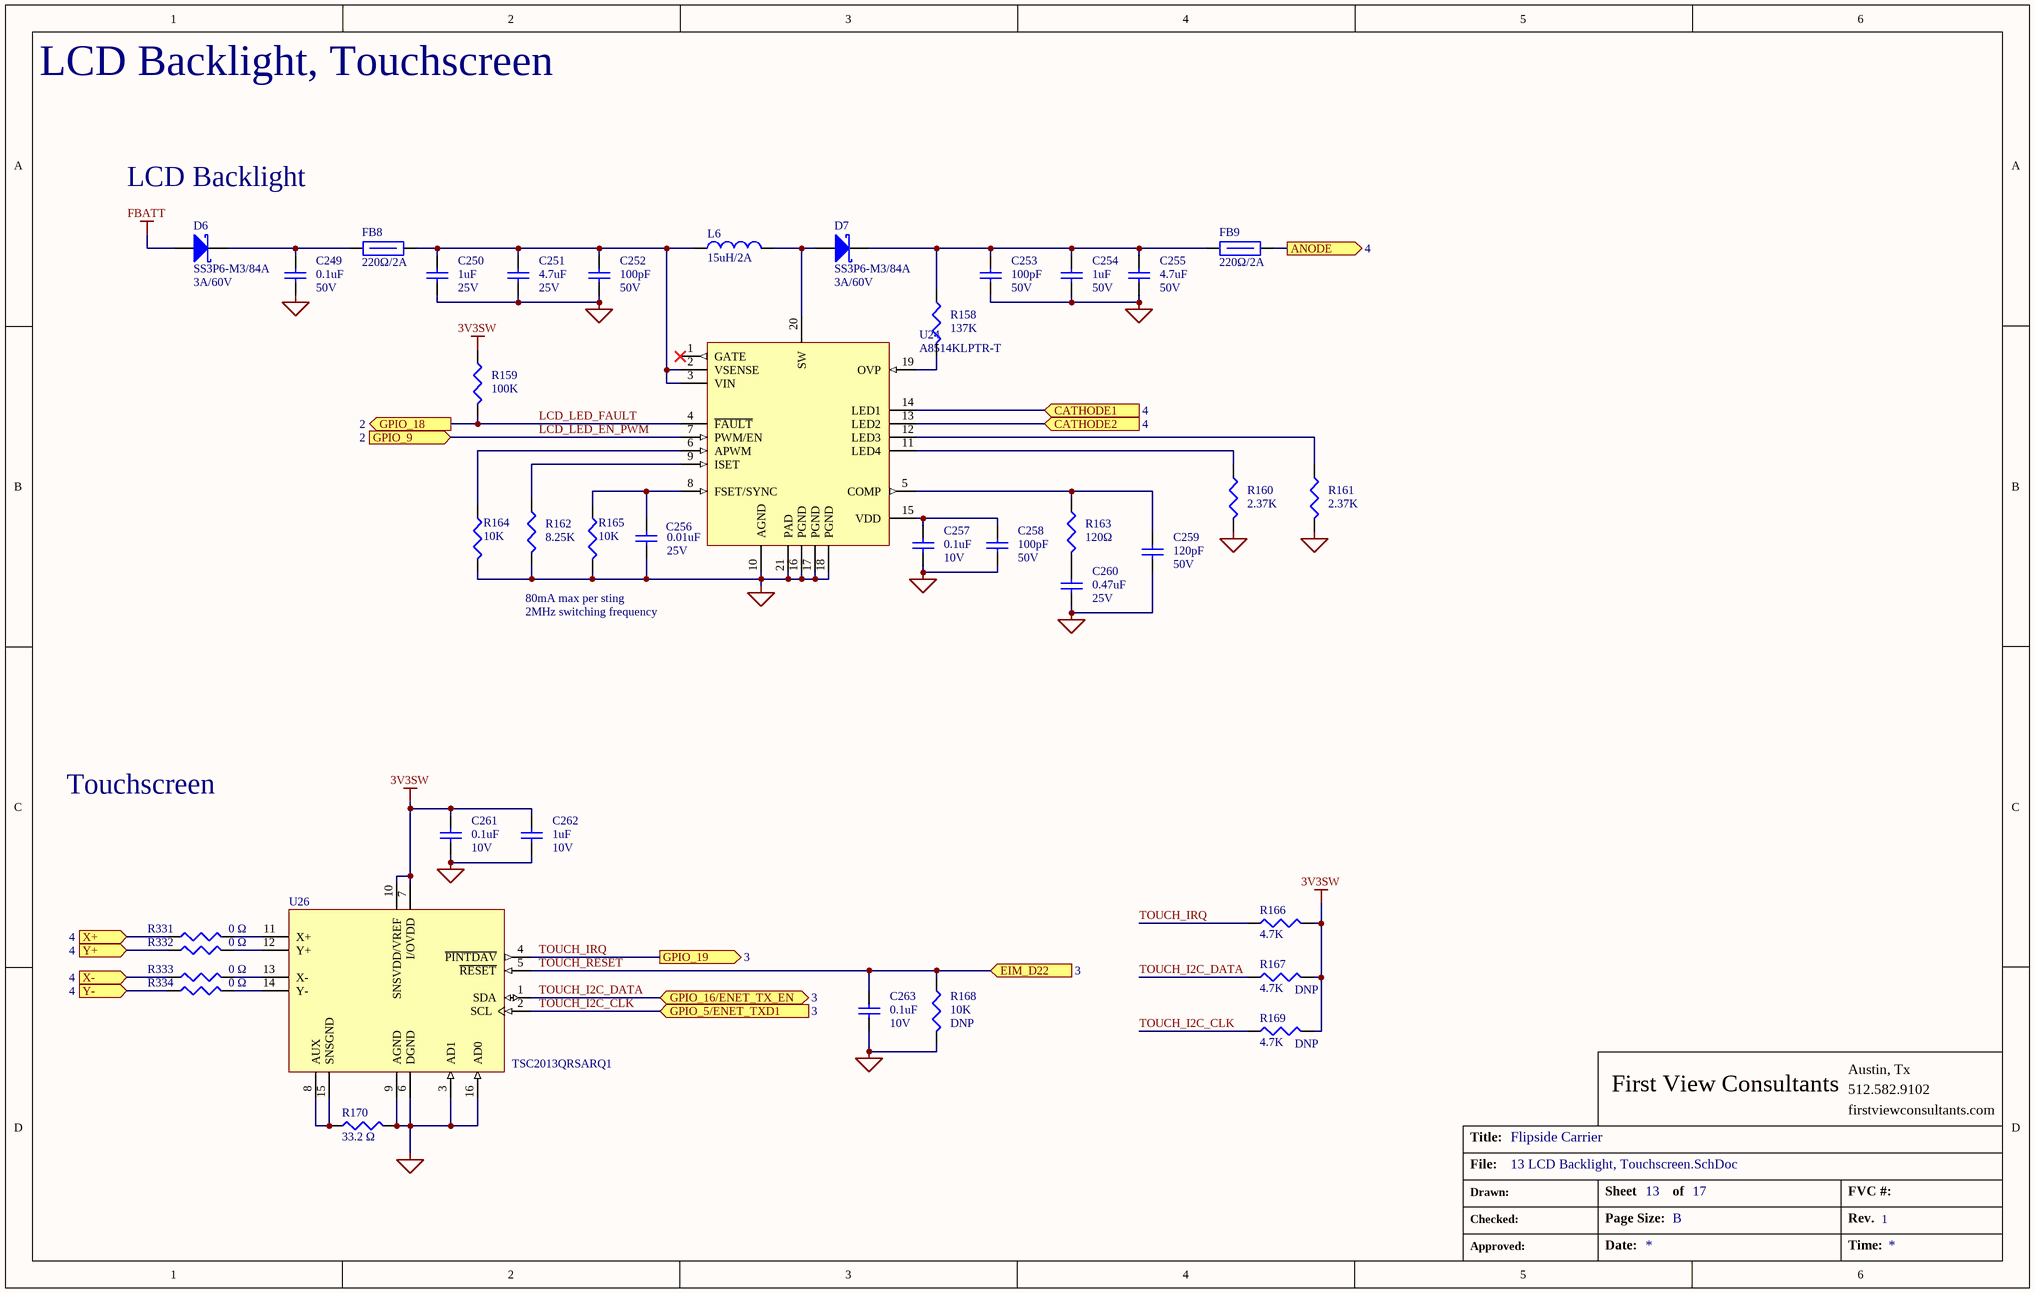
[diagram p12: 13 LCD Backlight, Touchscreen.SchDoc]

### Parts
C249  value 0.1uF  Voltage: 50V  [CAP_0402]  (hidden comment: Cap 0.1uF 50V 0402)
C250  value 1uF  Voltage: 25V  [CAP_0402]  (hidden comment: Cap 1uF 25V 0402)
C251  value 4.7uF  Voltage: 25V  [CAP_0805]  (hidden comment: Cap 4.7uF 25V 0805)
C252  value 100pF  Voltage: 50V  [CAP_0402]  (hidden comment: Cap 100pF 50V 0402)
C253  value 100pF  Voltage: 50V  [CAP_0402]  (hidden comment: Cap 100pF 50V 0402)
C254  value 1uF  Voltage: 50V  [CAP_1206]  (hidden comment: Cap 1uF 50V 1206)
C255  value 4.7uF  Voltage: 50V  [CAP_1206]  (hidden comment: Cap 4.7uF 50V 1206)
C256  value 0.01uF  Voltage: 25V  [CAP_0402]  (hidden comment: Cap 0.01uF 50V 0402)
C257  value 0.1uF  Voltage: 10V  [CAP_0402]  (hidden comment: Cap 0.1uF 10V 0402)
C258  value 100pF  Voltage: 50V  [CAP_0402]  (hidden comment: Cap 100pF 50V 0402)
C259  value 120pF  Voltage: 50V  [CAP_0402]  (hidden comment: Cap 120pF 50V 0402)
C260  value 0.47uF  Voltage: 25V  [CAP_0603]  (hidden comment: Cap 0.47uF 25V 0603)
C261  value 0.1uF  Voltage: 10V  [CAP_0402]  (hidden comment: Cap 0.1uF 10V 0402)
C262  value 1uF  Voltage: 10V  [CAP_0402]  (hidden comment: Cap 1uF 10V 0402)
C263  value 0.1uF  Voltage: 10V  [CAP_0402]  (hidden comment: Cap 0.1uF 10V 0402)
D6  SS3P6-M3/84A  value 3A/60V  [DO-220AA_SS3P6-M3/84A]
D7  SS3P6-M3/84A  value 3A/60V  [DO-220AA_SS3P6-M3/84A]
FB8  value 220Ω/2A  [IND_0805]  (hidden comment: BKP2125HS221-T)
FB9  value 220Ω/2A  [IND_0805]  (hidden comment: BKP2125HS221-T)
L6  value 15uH/2A  [IND_NRS8030T150MJGJ]  (hidden comment: NRS8030T150MJGJ)
R158  value 137K  [RES_0402]  (hidden comment: Res 137K 0.1W)
R159  value 100K  [RES_0402]  (hidden comment: Res 100K 0.1W)
R160  value 2.37K  [RES_0402]  (hidden comment: Res 2.37K 0.063W)
R161  value 2.37K  [RES_0402]  (hidden comment: Res 2.37K 0.063W)
R162  value 8.25K  [RES_0402]  (hidden comment: Res 8.25K 0.063W)
R163  value 120Ω  [RES_0402]  (hidden comment: Res 120R 0.063W)
R164  value 10K  [RES_0402]  (hidden comment: Res 10K 0.063W)
R165  value 10K  [RES_0402]  (hidden comment: Res 10K 0.063W)
R166  value 4.7K  [RES_0402]  (hidden comment: Res 4.7K 0.063W)
R167  value 4.7K  [RES_0402]  (hidden comment: Res 4.7K 0.063W)
R168  value 10K  [RES_0402]  (hidden comment: Res 10K 0.063W)
R169  value 4.7K  [RES_0402]  (hidden comment: Res 4.7K 0.063W)
R170  value 33.2 Ω  [RES_0402]  (hidden comment: Res 33.2R 0.063W)
R331  value 0 Ω  [RES_0402]  (hidden comment: Res 0 ohm 0.1W)
R332  value 0 Ω  [RES_0402]  (hidden comment: Res 0 ohm 0.1W)
R333  value 0 Ω  [RES_0402]  (hidden comment: Res 0 ohm 0.1W)
R334  value 0 Ω  [RES_0402]  (hidden comment: Res 0 ohm 0.1W)
U24  A8514KLPTR-T  [TSSOP-20_A8514KLPTR-T]
U26  TSC2013QRSARQ1  [QFN-16_TSC2013QRSARQ1]

### Ports
ANODE (out, see 4), CATHODE1 (in, see 4), CATHODE2 (in, see 4), EIM_D22 (in, see 3), GPIO_5/ENET_TXD1 (in, see 3), GPIO_9 (in, see 2), GPIO_16/ENET_TX_EN (bidir, see 3), GPIO_18 (out, see 2), GPIO_19 (out, see 3), X+ (in, see 4), X- (in, see 4), Y+ (in, see 4), Y- (in, see 4)

### Nets
3V3SW: C261.1 C262.1 R159.1 R166.2 R167.2 R169.2 U26.7(I/OVDD) U26.10(SNSVDD/VREF)
FBATT: D6.A
GND: C249.2 C250.2 C251.2 C252.2 C253.2 C254.2 C255.2 C256.2 C257.2 C258.2 C259.2 C260.2 C261.2 C262.2 C263.2 R160.2 R161.2 R162.2 R164.2 R165.2 R168.2 R170.2 U24.10(AGND) U24.16(PGND) U24.17(PGND) U24.18(PGND) U24.21(PAD) U26.3(AD1) U26.6(DGND) U26.9(AGND) U26.16(AD0)
LCD_LED_EN_PWM: U24.7(PWM/EN) ; port GPIO_9
LCD_LED_FAULT: R159.2 U24.4(~{FAULT}) ; port GPIO_18
TOUCH_I2C_CLK: R169.1 U26.2(SCL) ; port GPIO_5/ENET_TXD1
TOUCH_I2C_DATA: R167.1 U26.1(SDA) ; port GPIO_16/ENET_TX_EN
TOUCH_IRQ: R166.1 U26.4(~{PINTDAV}) ; port GPIO_19
TOUCH_RESET: C263.1 R168.1 U26.5(~{RESET}) ; port EIM_D22
NetC42_1: FB9.2 ; port ANODE
NetC43_1: U24.14(LED1) ; port CATHODE1
NetC44_1: U24.13(LED2) ; port CATHODE2
NetC53_1: R332.1 ; port Y+
NetC54_1: R331.1 ; port X+
NetC55_1: R334.1 ; port Y-
NetC56_1: R333.1 ; port X-
NetC249_1: C249.1 D6.K FB8.1
NetC250_1: C250.1 C251.1 C252.1 FB8.2 L6.1 U24.2(VSENSE) U24.3(VIN)
NetC253_1: C253.1 C254.1 C255.1 D7.K FB9.1 R158.1
NetC256_1: C256.1 R165.1 U24.8(FSET/SYNC)
NetC257_1: C257.1 C258.1 U24.15(VDD)
NetC259_1: C259.1 R163.1 U24.5(COMP)
NetC260_1: C260.1 R163.2
NetD7_A: D7.A L6.2 U24.20(SW)
NetR158_2: R158.2 U24.19(OVP)
NetR160_1: R160.1 U24.11(LED4)
NetR161_1: R161.1 U24.12(LED3)
NetR162_1: R162.1 U24.9(ISET)
NetR164_1: R164.1 U24.6(APWM)
NetR170_1: R170.1 U26.8(AUX) U26.15(SNSGND)
NetR331_2: R331.2 U26.11(X+)
NetR332_2: R332.2 U26.12(Y+)
NetR333_2: R333.2 U26.13(X-)
NetR334_2: R334.2 U26.14(Y-)

Not connected (* = marked no-connect by the designer): U24 1(GATE)*

### Notes on the sheet
- LCD Backlight, Touchscreen
- LCD Backlight
- 80mA max per sting
- 2MHz switching frequency
- Touchscreen
- First View Consultants
- Austin, Tx
- 512.582.9102
- Title:
- File:
- firstviewconsultants.com
- Drawn:
- Checked:
- Sheet
- Page Size:
- of
- B
- FVC #:
- Rev.
- Approved:
- Date:
- Time:

### Library data of the parts
C249 = Cap 0.1uF 50V 0402: Cap, Cer, 0.1uF, 50V, 10%, X5R, 0402; Manufacturer #: C1005X5R1H104K; Manufacturer: TDK Corporation; Have Footprint: yes; Tolerance: ±10%; Package: 0402
C250 = Cap 1uF 25V 0402: as C231 on sheet 11 Camera Input; Package: 0402
C251 = Cap 4.7uF 25V 0805: Cap, Cer, 4.7uF, 25V, 10%, X5R, 0805; Manufacturer: Murata Electronics North America; Manufacturer #: GRM21BR61E475KA12K; Have Footprint: yes; Tolerance: 10%; PACKAGE: 0805
C252 C253 C258 = Cap 100pF 50V 0402: Cap, Cer, 100pF, 50V, 5%, C0G/NP0, 0402; Manufacturer: Yageo; Manufacturer #: CC0402JRNPO9BN101; Have Footprint: yes; Tolerance: 5%; PACKAGE: 0402
C254 = Cap 1uF 50V 1206: Cap, Cer, 1uF, 50V, 10%, X7R, 1206; Manufacturer #: GRM31MR71H105KA88K; Manufacturer: Murata Electronics North America; Have Footprint: yes; Package: 1206; Operating Temperature: -55°C ~ 125°C
C255 = Cap 4.7uF 50V 1206: Cap, Cer, 4.7uF, 50V, 10%, X7R, 1206; Manufacturer: Taiyo Yuden; Manufacturer #: UMK316AB7475KL-T; Have Footprint: yes; Tolerance: 10%; PACKAGE: 1206
C256 = Cap 0.01uF 50V 0402: as C236 on sheet 11 Camera Input; Tolerance: ±10%; Package: 0402
C257 C261 C263 = Cap 0.1uF 10V 0402: as C199-C202 on sheet 11 Camera Input; Tolerance: ±10%; PACKAGE: 0402
C259 = Cap 120pF 50V 0402: Cap, Cer, 120pF, 50V, 5%, C0G/NP0, 0402; Manufacturer: Taiyo Yuden; Manufacturer #: UMK105CG121JV-F; Have Footprint: yes; Tolerance: 5%; PACKAGE: 0402
C260 = Cap 0.47uF 25V 0603: Cap, Cer, 0.47uF, 25V, 10%, X7R, 0603; Manufacturer: Samsung Electro-Mechanics America, Inc; Manufacturer #: CL10B474KA8NFNC; Have Footprint: yes; Package: 0603; Tolerance: 10%
C262 = Cap 1uF 10V 0402: Cap, Cer, 1uF, 10V, ±10%, X5R, 0402; Manufacturer #: CC0402KRX5R6BB105; Manufacturer: Yageo; Have Footprint: yes; Package: 0402
D6 D7 = SS3P6-M3/84A: Diode, Schottky, 3A, 60V, DO-220AA; Manufacturer: Vishay; Package: DO-220AA; Manufacturer #: SS3P6-M3/84A
FB8 FB9 = BKP2125HS221-T: Ind, Ferrite Bead, 220R, 50mOhm, 2A, 0805; Manufacturer: Taiyo Yuden; Manufacturer #: BKP2125HS221-T; Package: 0805
L6 = NRS8030T150MJGJ: Ind, Power, 15uH, 2A, 78mOhms, Shielded, SMD; Manufacturer: Taiyo Yuden; Operating Temperature: 25°C ~ 125°C; Package: SMD (8x8); Manufacturer #: NRS8030T150MJGJ
R158 = Res 137K 0.1W: Res, 137K, 0.1W, 1%, 0402; Manufacturer #: ERJ-2RKF1373X; Manufacturer: Panasonic Electronic Components; Have Footprint: yes; Package: 0402
R159 = Res 100K 0.1W: Res, 100K, 0.1W, 1%, 0402; Manufacturer #: ERJ-2RKF1003X; Manufacturer: Panasonic Electronic Components; Have Footprint: yes; Package: 0402
R160 R161 = Res 2.37K 0.063W: Res, 2.37K, 0.063W, 1%, 0402; Manufacturer #: RC0402FR-072K37L; Manufacturer: Yageo; Have Footprint: yes; Package: 0402
R162 = Res 8.25K 0.063W: Res, 8.25K, 0.063W, 1%, 0402; Manufacturer #: RC0402FR-078K25L; Manufacturer: Yageo; Have Footprint: yes; Package: 0402
R163 = Res 120R 0.063W: Res, 120R, 0.063W, 1%, 0402; Manufacturer #: MCR01MRTF1200; Manufacturer: Rohm Semiconductor; Have Footprint: yes; Package: 0402
R164 R165 R168 = Res 10K 0.063W: as R143 on sheet 11 Camera Input; Package: 0402
  R168: DNP: DNP
R166 R167 R169 = Res 4.7K 0.063W: as R141 on sheet 11 Camera Input; Package: 0402
  R167 R169: DNP: DNP
R170 = Res 33.2R 0.063W: Res, 33.2R, 0.063W, 1%, 0402; Manufacturer #: RC0402FR-0733R2L; Manufacturer: Yageo; Have Footprint: yes; Package: 0402
R331-R334 = Res 0 ohm 0.1W: as R119-R122 on sheet 11 Camera Input; Package: 0402
U24 = A8514KLPTR-T: IC, LED Driver, 5-40V, PWM 580k-2.3MHz, TSSOP-20; Manufacturer: Allegro; Have Footprint: yes; RoHS: yes; Manufacturer #: A8514KLPTR-T
U26 = TSC2013QRSARQ1: IC, TS Controller, I2C, 12-bit, 4-wire, 1.6-3.6V, QFN-16; Manufacturer: Texas Instruments; Manufacturer #: TSC2013QRSARQ1